# Altium schematic sheet CC-S05-V00-MicrocontrollerPeripherals.SchDoc: Microcontroller Peripherals (USB FS, SD Card, LEDs)
size A3; DrawnBy: Jonn Dillon; DocumentNumber: 6; SheetNumber: 6; SheetTotal: 13; Project: Chassis Controller (Interim) 2020
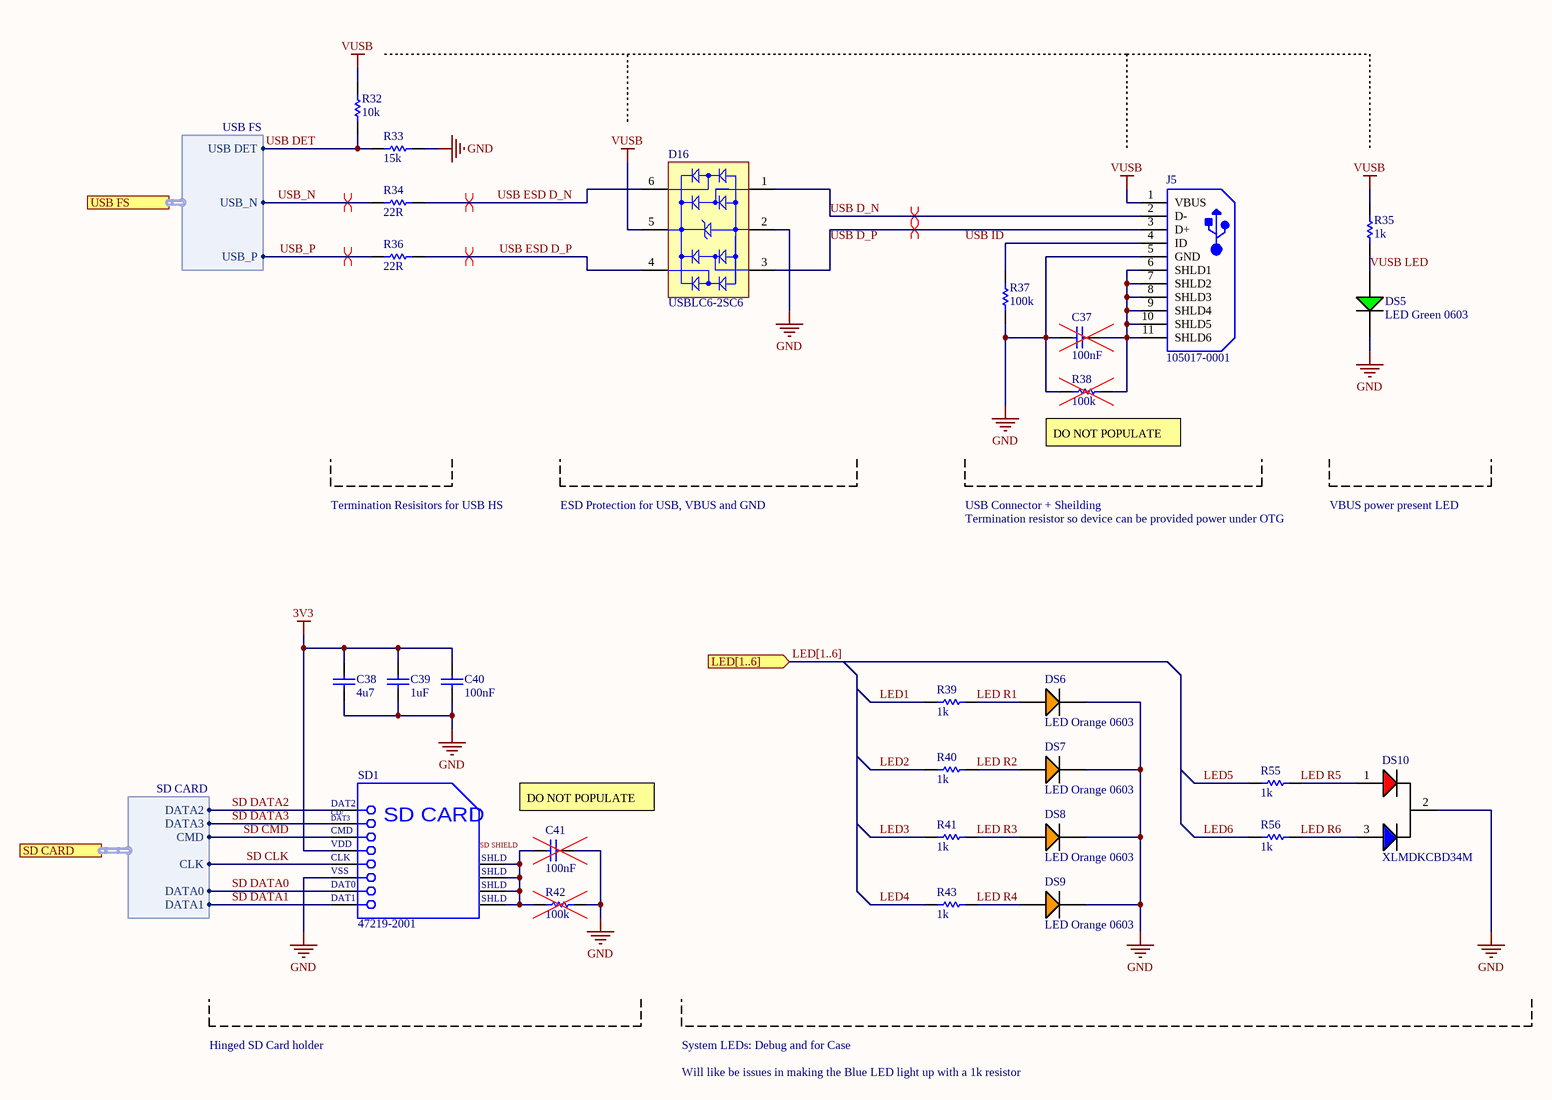
[diagram p0: CC-S05-V00-MicrocontrollerPeripherals.SchDoc]

## Parts
C37  100nF  [Cap_Ceramic_0603]
C38  4u7  [Cap_Ceramic_0603]
C39  1uF  [Cap_Ceramic_0603]
C40  100nF  [Cap_Ceramic_0603]
C41  100nF  [Cap_Ceramic_0603]
D16  USBLC6-2SC6  [USBLC6-2SC6]
DS5  LED Green 0603  [LED GREEN 0603]
DS6  LED Orange 0603  [LED ORANGE 0603]
DS7  LED Orange 0603  [LED ORANGE 0603]
DS8  LED Orange 0603  [LED ORANGE 0603]
DS9  LED Orange 0603  [LED ORANGE 0603]
DS10  XLMDKCBD34M  [XLxxxx34x]
J5  105017-0001  [105017-0001]
R32  10k  [Res_ThinFilm_0603]
R33  15k  [Res_ThinFilm_0603]
R34  22R  [Res_ThinFilm_0603]
R35  1k  [Res_ThinFilm_0603]
R36  22R  [Res_ThinFilm_0603]
R37  100k  [Res_ThinFilm_0603]
R38  100k  [Res_ThinFilm_0603]
R39  1k  [Res_ThinFilm_0603]
R40  1k  [Res_ThinFilm_0603]
R41  1k  [Res_ThinFilm_0603]
R42  100k  [Res_ThinFilm_0603]
R43  1k  [Res_ThinFilm_0603]
R55  1k  [Res_ThinFilm_0603]
R56  1k  [Res_ThinFilm_0603]
SD1  47219-2001  [47219-2001]

## Ports
LED[1..6] (in), SD CARD (harness SD CARD), USB FS (harness USB FS)

## Harnesses
USB FS: USB DET, USB_N, USB_P
SD CARD: DATA2, DATA3, CMD, CLK, DATA0, DATA1

## Nets
3V3: C38.2 C39.2 C40.2 SD1.4(VDD)
GND: C37.1 C38.1 C39.1 C40.1 C41.2 D16.2(GND) DS5.2(C) DS6.2(C) DS7.2(C) DS8.2(C) DS9.2(C) DS10.2(C) J5.5(GND) R33.2 R37.1 R38.2 R42.1 SD1.6(VSS)
VUSB: D16.5(VBUS) J5.1(VBUS) R32.2 R35.2
LED1: R39.2
LED2: R40.2
LED3: R41.2
LED4: R43.2
LED5: R55.2
LED6: R56.2
LED R1: DS6.1(A) R39.1
LED R2: DS7.1(A) R40.1
LED R3: DS8.1(A) R41.1
LED R4: DS9.1(A) R43.1
LED R5: DS10.1(A) R55.1
LED R6: DS10.3(A) R56.1
SD CLK: SD1.5(CLK) ; port SD CARD.CLK
SD CMD: SD1.3(CMD) ; port SD CARD.CMD
SD DATA0: SD1.7(DAT0) ; port SD CARD.DATA0
SD DATA1: SD1.8(DAT1) ; port SD CARD.DATA1
SD DATA2: SD1.1(DAT2) ; port SD CARD.DATA2
SD DATA3: SD1.2(CD/DAT3) ; port SD CARD.DATA3
SD SHIELD: C41.1 R42.2 SD1.9(SHLD) SD1.10(SHLD) SD1.11(SHLD) SD1.12(SHLD)
USB D_N: D16.1(I/O_1) J5.2(D-)
USB D_P: D16.3(I/O_2) J5.3(D+)
USB DET: R32.1 R33.1 ; port USB FS.USB DET
USB ESD D_N: D16.6(I/O_4) R34.2
USB ESD D_P: D16.4(I/O_3) R36.2
USB ID: J5.4(ID) R37.2
USB_N: R34.1 ; port USB FS.USB_N
USB_P: R36.1 ; port USB FS.USB_P
VUSB LED: DS5.1(A) R35.1
NetC37_2: C37.2 J5.6(SHLD1) J5.7(SHLD2) J5.8(SHLD3) J5.9(SHLD4) J5.10(SHLD5) J5.11(SHLD6) R38.1

## Buses and harness runs
bus LED[1..6] = port LED[1..6]

## Layout directives
differential pair: USB D_N, USB D_P, USB ESD D_N, USB ESD D_P, USB_N, USB_P

## Notes on the sheet
- (near R38) DO NOT POPULATE
- Termination Resisitors for USB HS
- ESD Protection for USB, VBUS and GND
- USB Connector + Sheilding
- Termination resistor so device can be provided power under OTG
- VBUS power present LED
- DO NOT POPULATE
- Hinged SD Card holder
- System LEDs: Debug and for Case
- Will like be issues in making the Blue LED light up with a 1k resistor
- Revision History:
- Sheet Title:
- Rev
- Date
- Description
- Project:
- Size:
- Drawn By:
- A3
- Number:
- Revision:
- Sheet
- Version:
- of
- QUT Motorsport
- O-120, Gardens Point
- 2 George Street
- Brisbane, QLD 4000
- Australia
- Print Date:
- Print Time:
- File Name:
- (in symbol 47219-2001) CD/; DAT3; SD CARD

## Library data of the parts
C37 C40 C41 = 100nF 50V 5% X7R 0603: Capacitor, Ceramic, SMD, 100nF, 50V, 5%, X7R, 0603
C38 = 4u7 50V 5% X7R 0603: Capacitor, Ceramic, SMD, 4u7, 50V, 5%, X7R, 0603
C39 = 1uF 25V 5% X7R 0603: Capacitor, Ceramic, SMD, 1uF, 25V, 5%, X7R, 0603
D16 = USBLC6-2SC6: Very low capacitance ESD protection, 3.5 pF, -40 to 125 degC, 6-Pin SOT23, RoHS, Tape and Reel
DS10 = XLMDKCBD34M: Blue, Red 465nm Blue, 630nm Red LED Indication - Discrete 3.3V Blue, 1.95V Red Radial; ComponentLink1Description: Digikey; ComponentLink1URL: https://www.digikey.com.au/product-detail/en/sunled/XLMDKCBD34M/1497-1307-ND/4901632
J5 = 105017-0001: Micro-USB B Receptacle, Right Angle, Bottom Mount, Surface Mount, with Solder Tabs, -30 to 85 degC, 5-Pin USB, RoHS, Tape and Reel
R32 = 10k 5% 0603: Resistor, SMD, 10k, 0.1W, 5%, 0603
R33 = 15k 5% 0603: Resistor, SMD, 15k, 0.1W, 5%, 0603
R34 R36 = 22R 5% 0603: Resistor, SMD, 22R, 0.1W, 5%, 0603
R35 R39-R41 R43 R55 R56 = 1k 5% 0603: Resistor, SMD, 1k, 0.1W, 5%, 0603
R37 R38 R42 = 100k 5%, 0603: Resistor, SMD, 100k, 0.1W, 5%, 0603
SD1 = 47219-2001: MicroSD Card Connector, Hinge Type, -40 to 85 degC, 8-Pin SMD, RoHS, Tape and Reel